# Altium schematic sheet IsoTransformer.SchDoc: Isolation Transformer
size A4; DrawnBy: Alvin Ha; DocumentNumber: BMS2018-8; Revision: 1.0; SheetNumber: 8; SheetTotal: 9
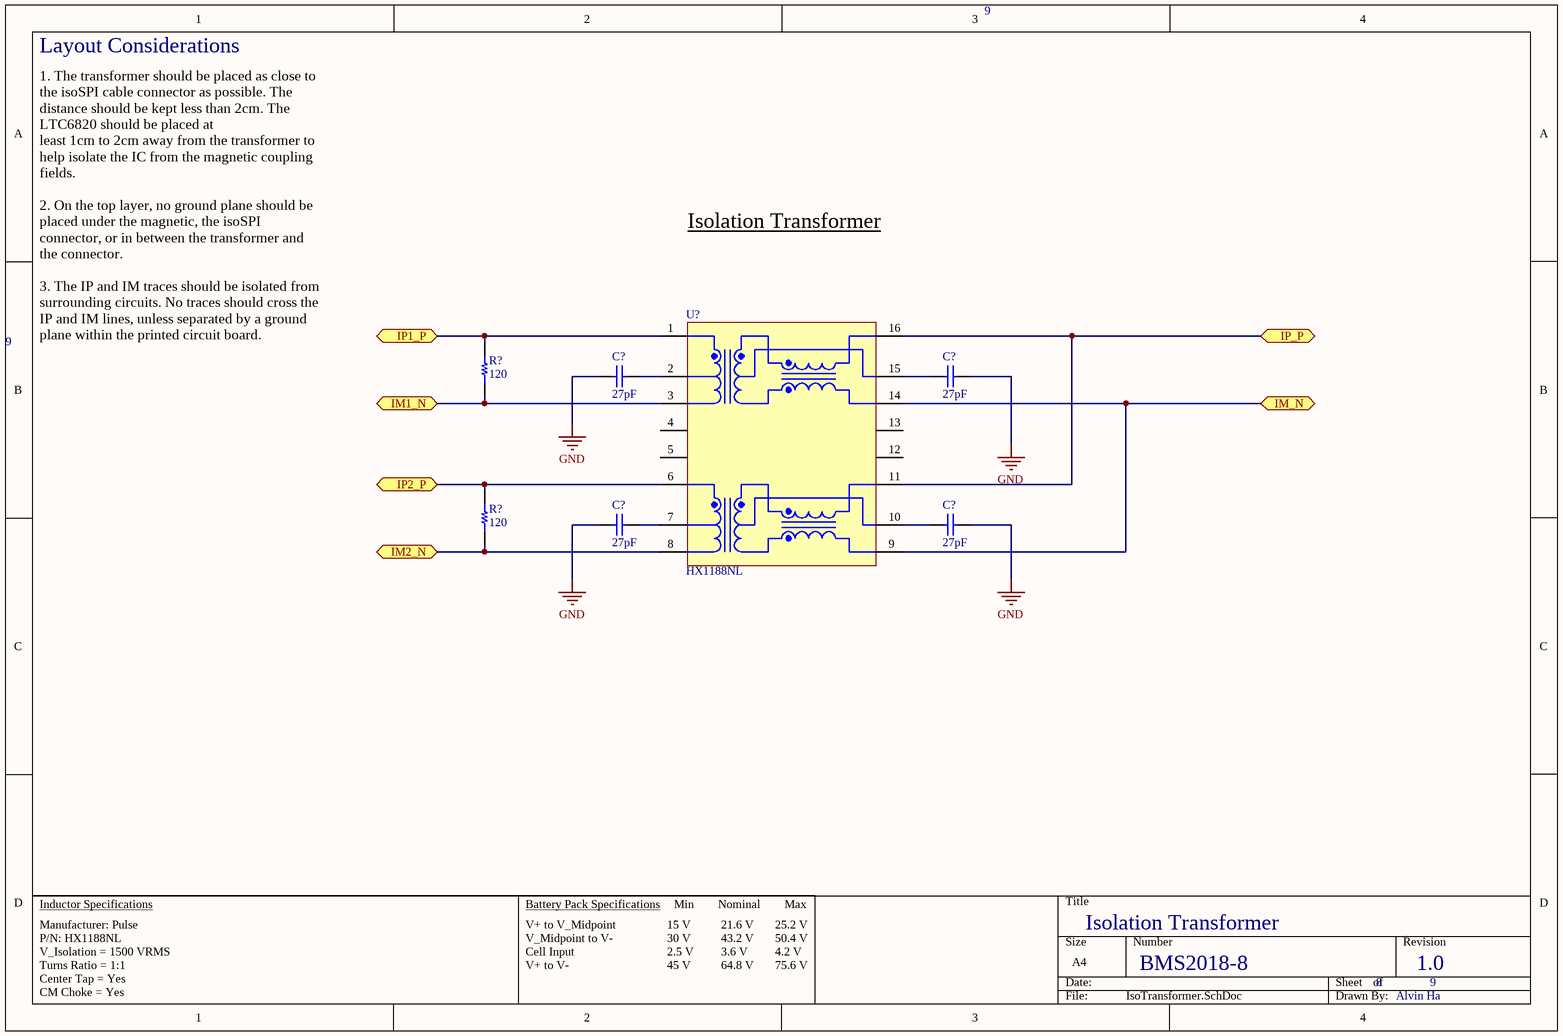
[diagram p0: IsoTransformer.SchDoc]

## Parts
(Parts that share a designator on the sheet are numbered #1, #2 ... from top to bottom, then left to right.)
C?#1  27pF  [CAP SMT 0603]
C?#2  27pF  [CAP SMT 0603]
C?#3  27pF  [CAP SMT 0603]
C?#4  27pF  [CAP SMT 0603]
R?#1  120  [RES SMT 0805]
R?#2  120  [RES SMT 0805]
U?  HX1188NL  [PULS-MODULE-16_V]

## Ports
IM1_N (bidir), IM2_N (bidir), IM_N (bidir), IP1_P (bidir), IP2_P (bidir), IP_P (bidir)

## Nets
GND: C?#1.1 C?#2.2 C?#3.1 C?#4.2
IM1_N: R?#1.1 U?.3 ; port IM1_N
IM2_N: R?#2.1 U?.8 ; port IM2_N
IM_N: U?.9 U?.14 ; port IM_N
IP1_P: R?#1.2 U?.1 ; port IP1_P
IP2_P: R?#2.2 U?.6 ; port IP2_P
IP_P: U?.11 U?.16 ; port IP_P
NetC?#1_2: C?#1.2 U?.2
NetC?#2_1: C?#2.1 U?.15
NetC?#3_2: C?#3.2 U?.7
NetC?#4_1: C?#4.1 U?.10

Not connected (* = marked no-connect by the designer): U? 4 5 12 13

## Notes on the sheet
- Layout Considerations
- Isolation Transformer
- 1. The transformer should be placed as close to the isoSPI cable connector as possible. The distance should be kept less than 2cm. The LTC6820 should be placed at
  least 1cm to 2cm away from the transformer to help isolate the IC from the magnetic coupling fields.
  2. On the top layer, no ground plane should be placed under the magnetic, the isoSPI connector, or in between the transformer and the connector.
  3. The IP and IM traces should be isolated from surrounding circuits. No traces should cross the IP and IM lines, unless separated by a ground plane within the printed circuit board.
- Inductor Specifications
- Battery Pack Specifications
- Min        Nominal        Max
- 15 V
  30 V
  2.5 V
  45 V
- 21.6 V
  43.2 V
  3.6 V
  64.8 V
- 25.2 V
  50.4 V
  4.2 V
  75.6 V
- Manufacturer: Pulse
  P/N: HX1188NL
  V_Isolation = 1500 VRMS
  Turns Ratio = 1:1
  Center Tap = Yes
  CM Choke = Yes
- V+ to V_Midpoint
  V_Midpoint to V-
  Cell Input
  V+ to V-

## Library data of the parts
C?#1-C?#4 = Capacitor 27pF 25V 0603: Supplier 1: Digi-Key; Supplier Part Number 1: 445-4661-6-ND
R?#1 R?#2 = Resistor 120 1% 0805: Supplier 1: Digi-Key; Supplier Part Number 1: 541-120CDKR-ND
U? = CMP-2000-05323-1: 10/100 Base-T Single Port Surface Mount Magnetic with Turns Ratio, -40 to 85 degC, 16-Pin Module, RoHS, Tube; Manufacturer: Pulse Electronics; Other Related Documents: PackagesFNLvs.NL; Other Names: 553-1340; PCN Design/Specification: ThermoplasticHeaderDesign28/Jun/2013; Transformer Type: IsolationandDataInterface(Encapsulated); PCN Other: HaloInjunctionRes1/Sep/2015; Turns Ratio - Primary: Secondary:1:1Transmitter,1:1Receiver; Family: PulseTransformers; Datasheet URL: https://datasheet.ciiva.com/26929/hx1188nl-26929858.pdf; Mounting Type: SurfaceMount; Size / Dimension: 12.70mmLx7.11mmW; Inductance: -; Package Description: 16-Pin Surface Mount Device, Body 12.7 x 7.11 mm, Pitch 1.27 mm; Height - Seated (Max): 6.22mm; E.T.: -; Online Catalog: 10/100BASE-TSinglePort; Manufacturer URL: http://www.pulseelectronics.com/; Package Reference: MODULE-16; Series: -; Category: Transformers; Standard Package: 40; Datasheet Version: Rev. H325.Q, 09/2009